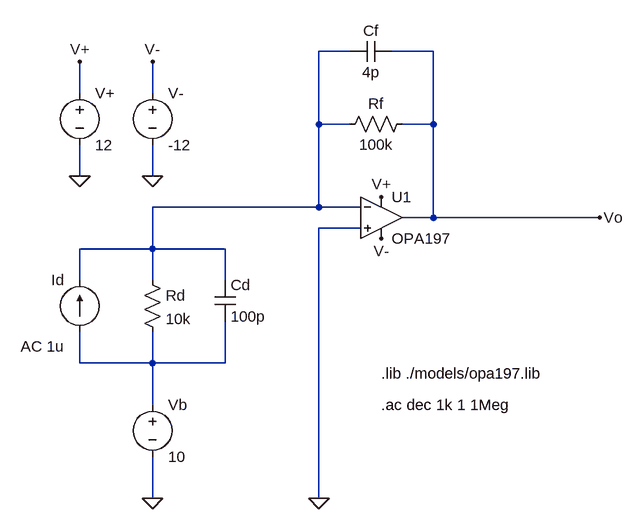
[diagram p0: schematic preamp.asc]
preamp.asc, the LTspice schematic file:
Version 4
SHEET 1 964 680
WIRE 528 -48 480 -48
WIRE 656 -48 592 -48
WIRE 112 16 112 -32
WIRE 224 16 224 -32
WIRE 480 64 480 -48
WIRE 528 64 480 64
WIRE 656 64 656 -48
WIRE 656 64 608 64
WIRE 112 144 112 96
WIRE 224 144 224 96
WIRE 480 192 480 64
WIRE 480 192 224 192
WIRE 544 192 480 192
WIRE 656 208 656 64
WIRE 656 208 608 208
WIRE 912 208 656 208
WIRE 544 224 480 224
WIRE 224 256 224 192
WIRE 224 256 112 256
WIRE 336 256 224 256
WIRE 112 304 112 256
WIRE 224 304 224 256
WIRE 336 304 336 256
WIRE 112 432 112 384
WIRE 224 432 224 384
WIRE 224 432 112 432
WIRE 336 432 336 368
WIRE 336 432 224 432
WIRE 224 496 224 432
WIRE 224 640 224 576
WIRE 480 640 480 224
FLAG 224 640 0
FLAG 480 640 0
FLAG 112 144 0
FLAG 224 144 0
FLAG 224 -32 V-
FLAG 112 -32 V+
FLAG 576 176 V+
FLAG 576 240 V-
FLAG 912 208 Vo
SYMBOL /current 112 384 R180
WINDOW 0 24 80 Left 2
WINDOW 3 24 0 Invisible 2
WINDOW 123 24 -22 Left 2
SYMATTR InstName Id
SYMATTR Value ""
SYMATTR Value2 AC 1u
SYMBOL /res 208 288 R0
SYMATTR InstName Rd
SYMATTR Value 10k
SYMBOL /cap 320 304 R0
SYMATTR InstName Cd
SYMATTR Value 100p
SYMBOL /voltage 224 480 R0
SYMATTR InstName Vb
SYMATTR Value 10
SYMBOL /Opamps/opamp2 576 144 R0
SYMATTR InstName U1
SYMATTR Value OPA197
SYMBOL /voltage 112 0 R0
SYMATTR InstName V+
SYMATTR Value 12
SYMBOL /voltage 224 0 R0
SYMATTR InstName V-
SYMATTR Value -12
SYMBOL /res 624 48 R90
WINDOW 0 0 56 VBottom 2
WINDOW 3 32 56 VTop 2
SYMATTR InstName Rf
SYMATTR Value 100k
SYMBOL /cap 592 -64 R90
WINDOW 0 0 32 VBottom 2
WINDOW 3 32 32 VTop 2
SYMATTR InstName Cf
SYMATTR Value 4p
TEXT 576 448 Left 2 !.lib ./models/opa197.lib
TEXT 576 496 Left 2 !.ac dec 1k 1 1Meg

The netlist it stands for:
* preamp.asc
Id N002 N001 AC 1u
Rd N001 N002 10k
Cd N001 N002 100p
Vb N002 0 10
XU1 0 N001 V+ V- Vo OPA197  ; pins In+ In- V+ V- OUT
V+ V+ 0 12
V- V- 0 -12
Rf Vo N001 100k
Cf Vo N001 4p
.lib ./models/opa197.lib
.ac dec 1k 1 1Meg
.backanno
.end